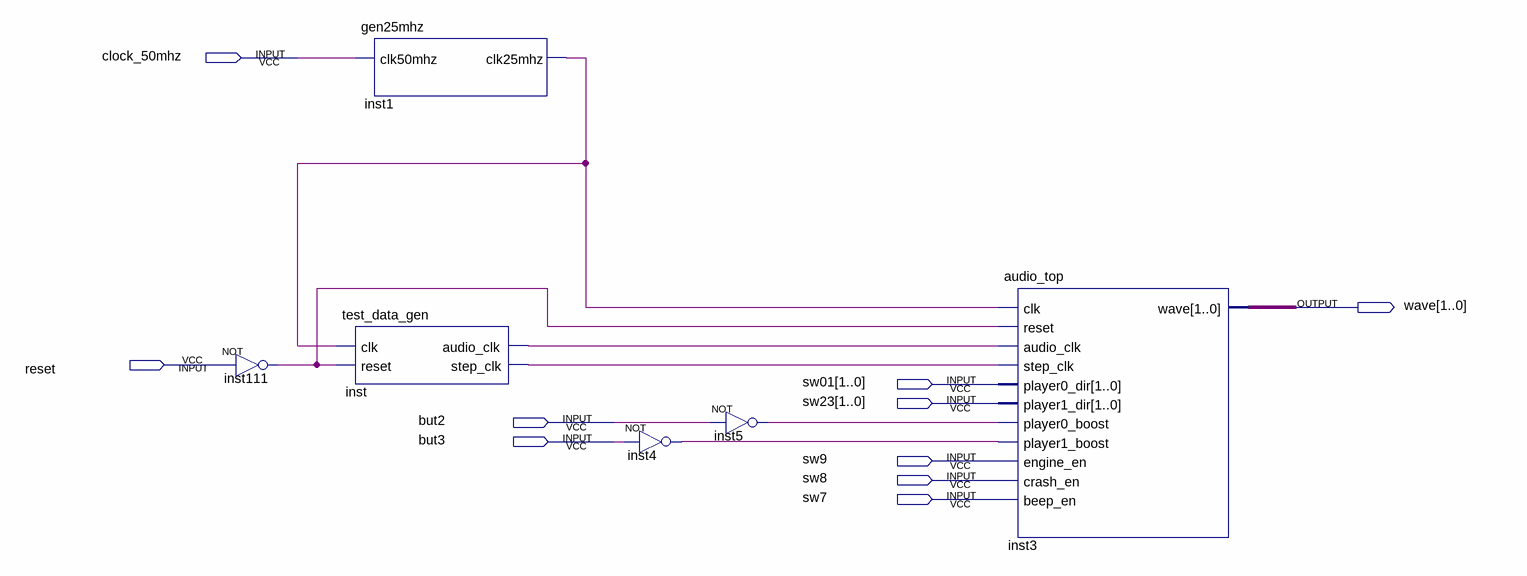
[diagram p0: schematic sheet]
// Quartus schematic top_de1.bdf as structural Verilog: 6 symbols, 10 pins
module top_de1 (
  input  clock_50mhz,
  input  reset,
  input  [1:0] sw01,
  input  [1:0] sw23,
  input  but2,
  input  but3,
  input  sw9,
  input  sw8,
  input  sw7,
  output [1:0] wave
);

  wire inst1_clk25mhz, inst4_out, inst5_out, inst111_out, inst_audio_clk, inst_step_clk;

  not inst111 (inst111_out, reset);
  test_data_gen inst (.clk(inst1_clk25mhz), .reset(inst111_out), .audio_clk(inst_audio_clk), .step_clk(inst_step_clk));
  gen25mhz inst1 (.clk50mhz(clock_50mhz), .clk25mhz(inst1_clk25mhz));
  not inst4 (inst4_out, but3);
  not inst5 (inst5_out, but2);
  audio_top inst3 (
    .clk(inst1_clk25mhz), .reset(inst111_out), .audio_clk(inst_audio_clk), .step_clk(inst_step_clk),
    .player0_dir(sw01), .player1_dir(sw23), .player0_boost(inst5_out), .player1_boost(inst4_out),
    .engine_en(sw9), .crash_en(sw8), .beep_en(sw7), .wave(wave));
endmodule
